# Altium schematic sheet dc-dc.SchDoc
size A4
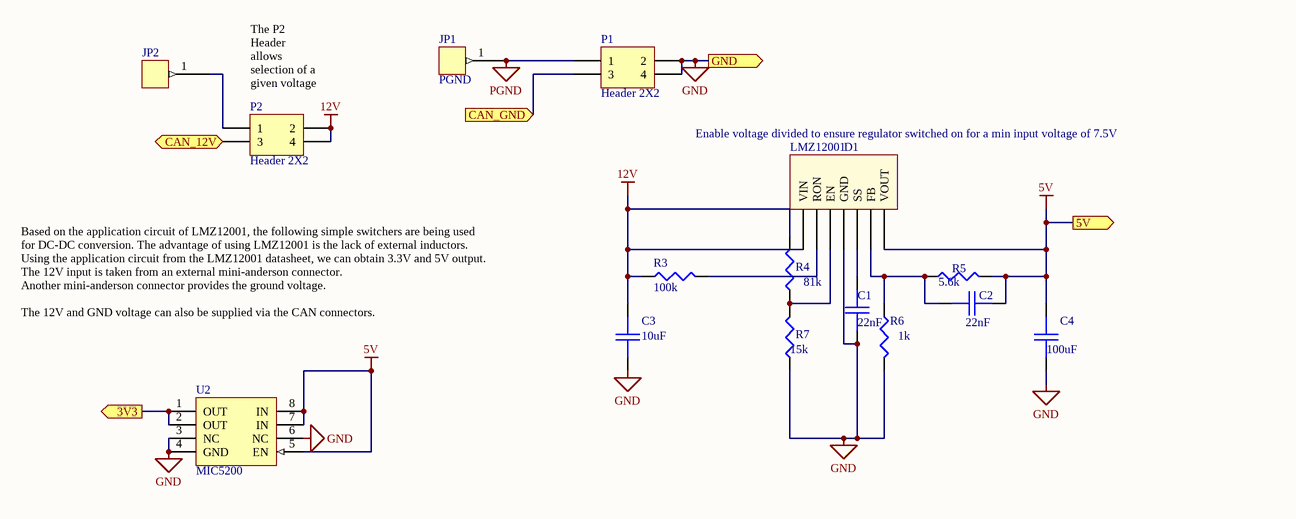
[diagram p0: dc-dc.SchDoc]

## Parts
C1  value 22nF  [0603]  (hidden comment: CAP)
C2  value 22nF  [0603]  (hidden comment: CAP)
C3  value 10uF  [1206]  (hidden comment: CAP)
C4  value 100uF  [1206]  (hidden comment: CAP)
D1  DC-DC SWITCHER  [PFM-7]  (value not drawn)
JP1  PGND  [POWERPOLE25A]
JP2  CON1  [POWERPOLE25A]  (value not drawn)
P1  Header 2X2  [HDR2X2]
P2  Header 2X2  [HDR2X2]
R3  value 100k  [0603]  (hidden comment: RES1)
R4  value 81k  [0603]  (hidden comment: RES1)
R5  value 5.6k  [0603]  (hidden comment: RES1)
R6  value 1k  [0603]  (hidden comment: RES1)
R7  value 15k  [0603]  (hidden comment: RES1)
U2  MIC5200  [SO8]

## Ports
3V3 (out), 5V (out), CAN_12V (in), CAN_GND (in), GND (out)

## Nets
5V: C2.2 C4.1 D1.7(VOUT) R5.2 U2.5(EN) U2.7(IN) U2.8(IN) ; port 5V
12V: C3.1 D1.1(VIN) P2.2 P2.4 R3.1 R4.2
GND: C1.2 C3.2 C4.2 D1.4(GND) P1.2 P1.4 R6.2 R7.1 U2.3(NC) U2.4(GND) U2.6(NC) ; port GND
PGND: JP1.1 P1.1
3V3: U2.1(OUT) U2.2(OUT) ; port 3V3
CAN_12V: P2.3 ; port CAN_12V
CAN_GND: P1.3 ; port CAN_GND
NetC1_1: C1.1 D1.5(SS)
NetC2_1: C2.1 D1.6(FB) R5.1 R6.1
NetD1_2: D1.2(RON) R3.2
NetD1_3: D1.3(EN) R4.1 R7.2
NetJP2_1: JP2.1 P2.1

## Notes on the sheet
- (near P2) The P2 Header allows selection of a given voltage
- Enable voltage divided to ensure regulator switched on for a min input voltage of 7.5V
- LMZ12001
- Based on the application circuit of LMZ12001, the following simple switchers are being used
  for DC-DC conversion. The advantage of using LMZ12001 is the lack of external inductors.
  Using the application circuit from the LMZ12001 datasheet, we can obtain 3.3V and 5V output.
  The 12V input is taken from an external mini-anderson connector.
  Another mini-anderson connector provides the ground voltage.
  The 12V and GND voltage can also be supplied via the CAN connectors.

## Library data of the parts
C1-C4 = CAP: Capacitor
D1 = lmz12001
JP1 = CON1: Power Ground (currently assumed that it is provided through a min-anderson connector)
JP2 = CON1: Currently assumed that the mini-anderson connector provides 12V
P1 P2 = Header 2X2: Header, 2-Pin, Dual row; LatestRevisionDate: 17-Jul-2002; LatestRevisionNote: Re-released for DXP Platform.; Publisher: Altium Limited
R3-R7 = RES1: Resistor
U2 = MIC5200: MIC5200 - SO8